# Altium schematic sheet MB_pwr.SchDoc
size 840 x 594 mm; SheetNumber: 5; SheetTotal: 8
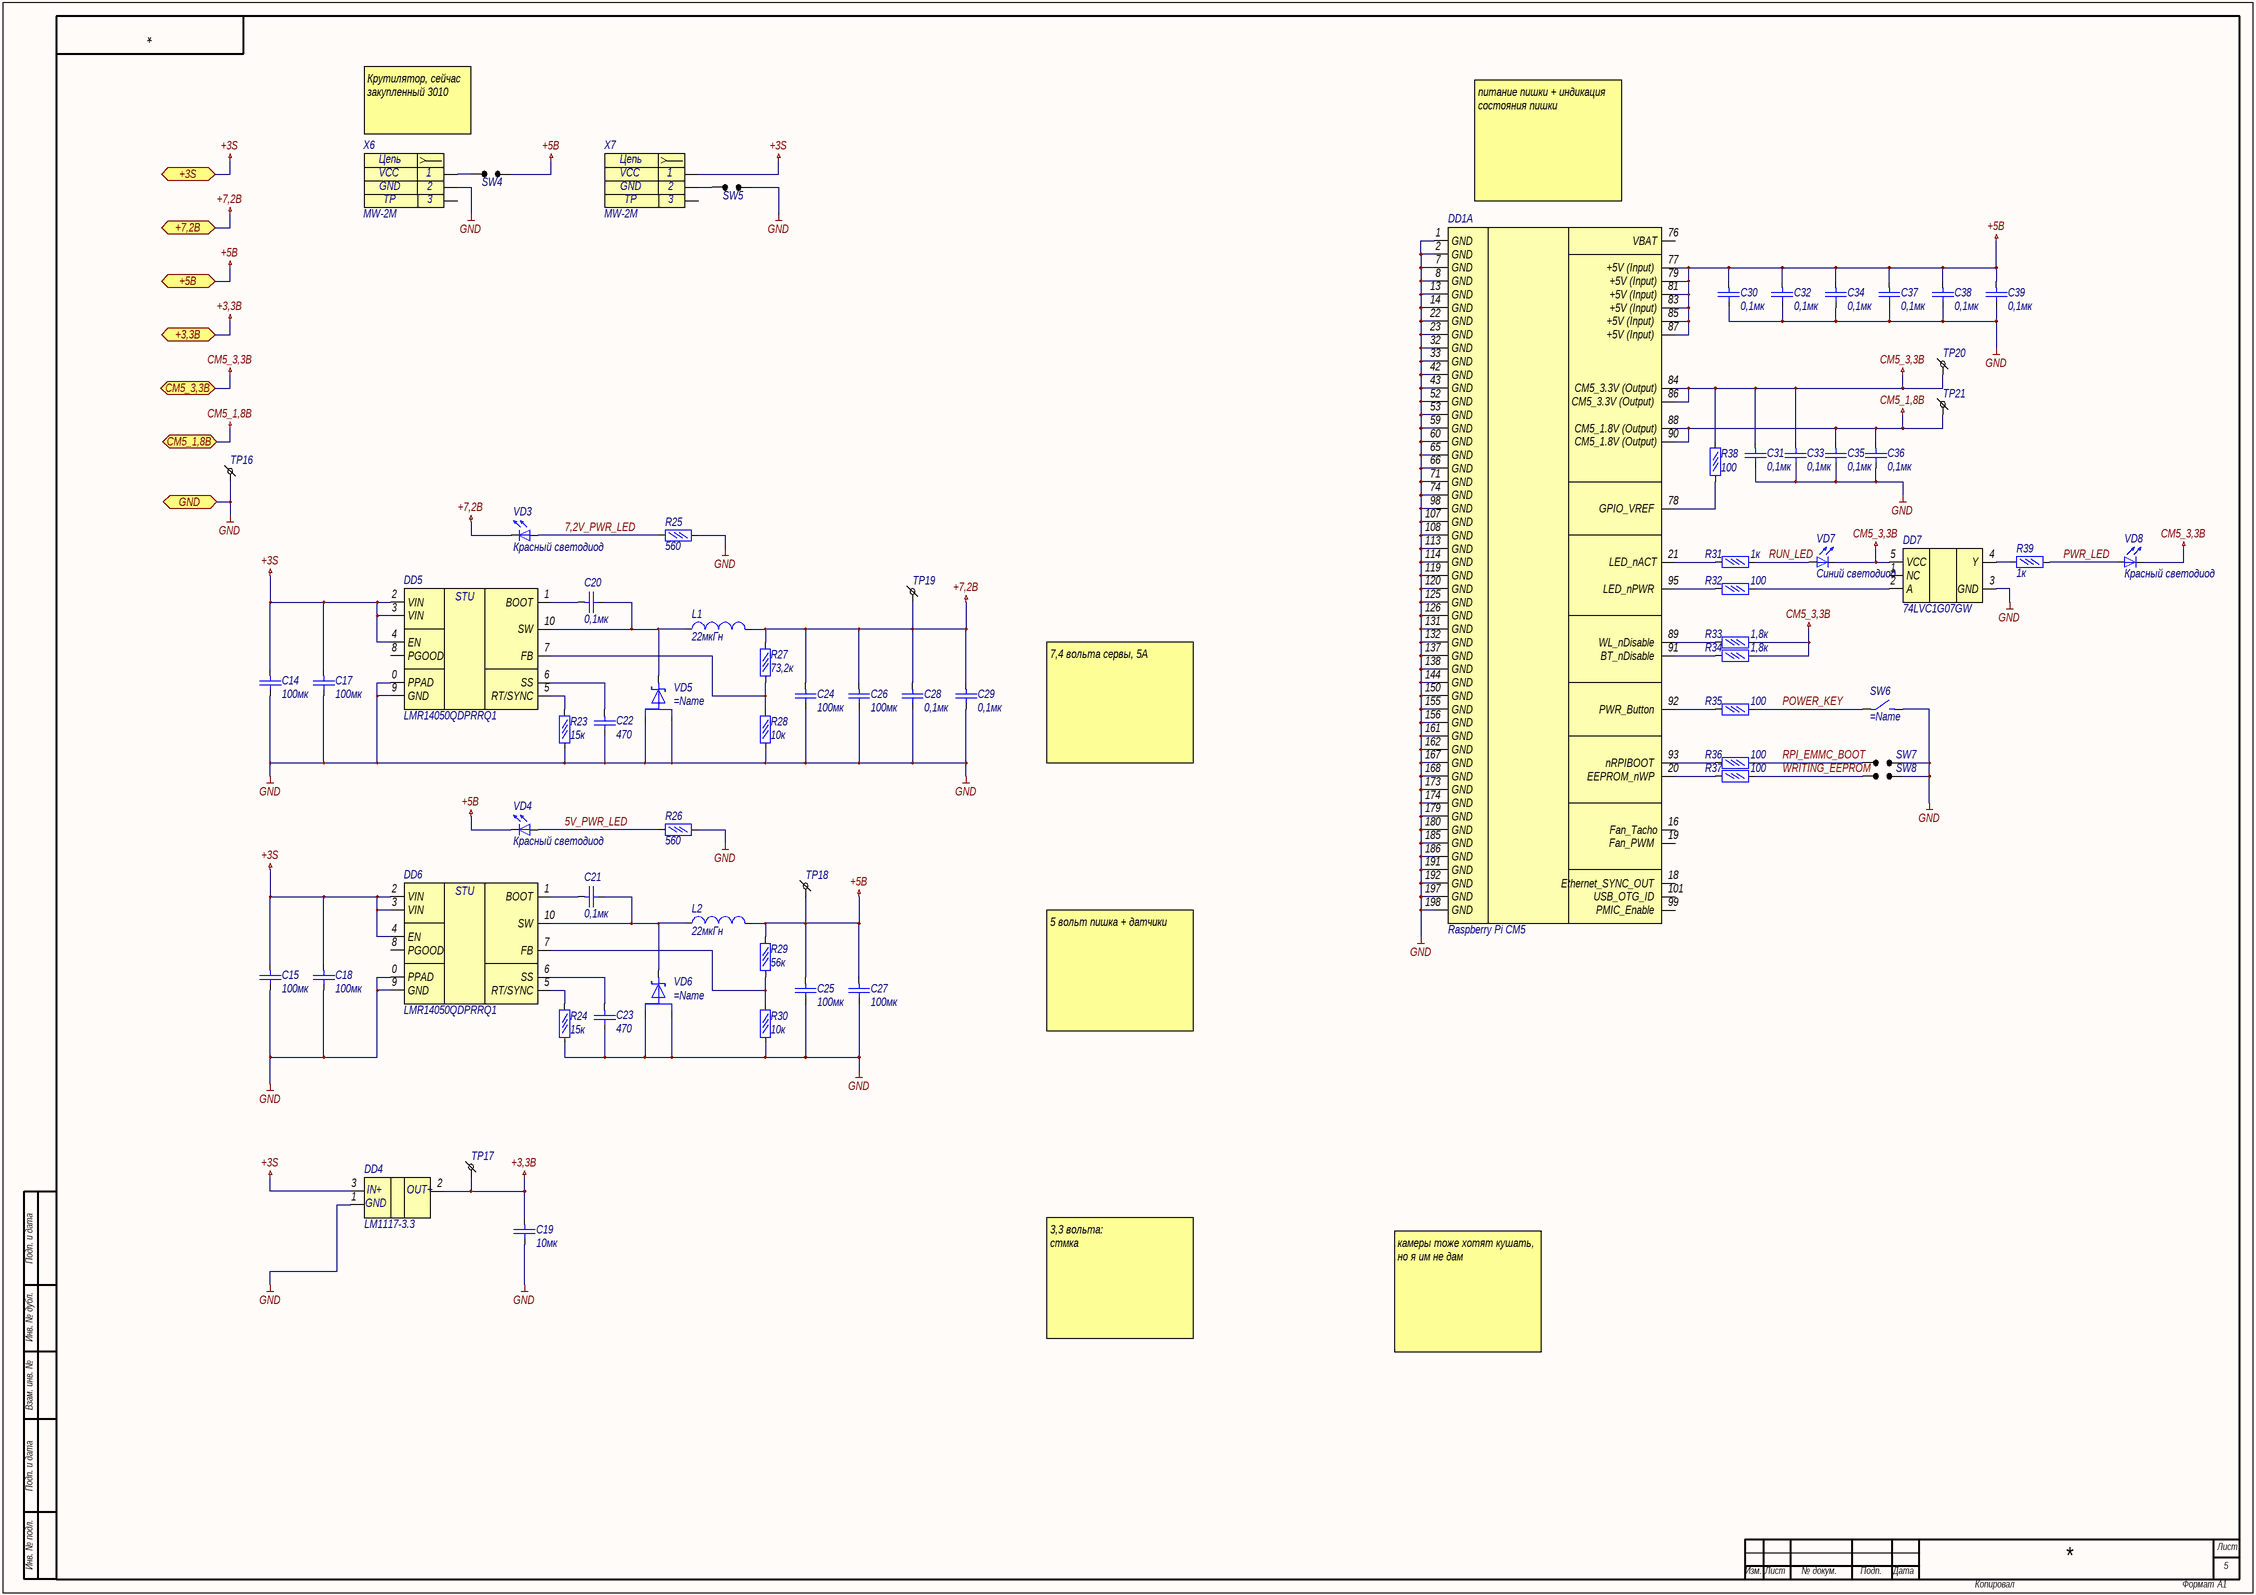
[diagram p0: MB_pwr.SchDoc]

## Parts
DD1  Raspberry Pi CM5  [raspberry_pi_compute_module_4_header]  (part A of 6)
DD4  LM1117-3.3  [SOT-223]
DD5  LMR14050QDPRRQ1  [WSON-10]
DD6  LMR14050QDPRRQ1  [WSON-10]
DD7  74LVC1G07GW  [SOT353]
L1  22мкГн  [SRP1038A]
L2  22мкГн  [SRP1038A]
R23  15к  [R0402]
R24  15к  [R0402]
R25  560  [R0402]
R26  560  [R0402]
R27  73,2к  [R0402]
R28  10к  [R0402]
R29  56к  [R0402]
R30  10к  [R0402]
R31  1к  [R0402]
R32  100  [R0402]
R33  1,8к  [R0402]
R34  1,8к  [R0402]
R35  100  [R0402]
R36  100  [R0402]
R37  100  [R0402]
R38  100  [R0402]
R39  1к  [R0402]
SW4  (no value)  [PLD 1.27X2]
SW5  (no value)  [PLD 1.27X2]
SW6  (no value)  [it-1187]
SW7  (no value)  [PLD 1.27X2]
SW8  (no value)  [PLD 1.27X2]
TP16  TestPoint  [0.5 x 0,9_round]  (value not drawn)
TP17  TestPoint  [0.5 x 0,9_round]  (value not drawn)
TP18  TestPoint  [0.5 x 0,9_round]  (value not drawn)
TP19  TestPoint  [0.5 x 0,9_round]  (value not drawn)
TP20  TestPoint  [0.5 x 0,9_round]  (value not drawn)
TP21  TestPoint  [0.5 x 0,9_round]  (value not drawn)
VD3  Красный светодиод  [0603 - led]
VD4  Красный светодиод  [0603 - led]
VD5  (no value)  [TO-277A]
VD6  (no value)  [TO-277A]
VD7  Синий светодиод  [0603 - led - no point]
VD8  Красный светодиод  [0603 - led - no point]
X6  MW-2M  [DS1020-02-02MVT1R]
X7  MW-2M  [MW-2M]
С14  100мк  [C1210_AA - 2.5]
С15  100мк  [C1210_AA - 2.5]
С17  100мк  [C1210_AA - 2.5]
С18  100мк  [C1210_AA - 2.5]
С19  10мк  [C0603]
С20  0,1мк  [C0402]
С21  0,1мк  [C0402]
С22  470  [C0402]
С23  470  [C0402]
С24  100мк  [C1210_AA - 2.5]
С25  100мк  [C1210_AA - 2.5]
С26  100мк  [C1210_AA - 2.5]
С27  100мк  [C1210_AA - 2.5]
С28  0,1мк  [C0402]
С29  0,1мк  [C0402]
С30  0,1мк  [C0402]
С31  0,1мк  [C0402]
С32  0,1мк  [C0402]
С33  0,1мк  [C0402]
С34  0,1мк  [C0402]
С35  0,1мк  [C0402]
С36  0,1мк  [C0402]
С37  0,1мк  [C0402]
С38  0,1мк  [C0402]
С39  0,1мк  [C0402]

## Ports
+3,3В (bidir), +3S (bidir), +5В (bidir), +7,2В (bidir), CM5_1,8В (bidir), CM5_3,3В (bidir), GND (bidir)

## Nets
+3,3В: DD4.2 TP17.1 С19.2 ; port +3,3В
+3S: DD4.3 DD5.2(VIN) DD5.3(VIN) DD5.4(EN) DD6.2(VIN) DD6.3(VIN) DD6.4(EN) X7.1 С14.2 С15.2 С17.2 С18.2 ; port +3S
+5В: DD1.77(+5V_(Input)) DD1.79(+5V_(Input)) DD1.81(+5V_(Input)) DD1.83(+5V_(Input)) DD1.85(+5V_(Input)) DD1.87(+5V_(Input)) L2.1 R29.2 SW4.2 TP18.1 VD4.2(K) С25.2 С27.2 С30.2 С32.2 С34.2 С37.2 С38.2 С39.2 ; port +5В
+7,2В: L1.1 R27.2 TP19.1 VD3.2(K) С24.2 С26.2 С28.2 С29.2 ; port +7,2В
CM5_1,8В: DD1.88(CM5_1.8V_(Output)) DD1.90(CM5_1.8V_(Output)) TP21.1 С35.2 С36.2 ; port CM5_1,8В
CM5_3,3В: DD1.84(CM5_3.3V_(Output)) DD1.86(CM5_3.3V_(Output)) DD7.5(VCC) R33.2 R34.2 R38.2 TP20.1 VD7.2(K) VD8.2(K) С31.2 С33.2 ; port CM5_3,3В
GND: DD1.1(GND) DD1.2(GND) DD1.7(GND) DD1.8(GND) DD1.13(GND) DD1.14(GND) DD1.22(GND) DD1.23(GND) DD1.32(GND) DD1.33(GND) DD1.42(GND) DD1.43(GND) DD1.52(GND) DD1.53(GND) DD1.59(GND) DD1.60(GND) DD1.65(GND) DD1.66(GND) DD1.71(GND) DD1.74(GND) DD1.98(GND) DD1.107(GND) DD1.108(GND) DD1.113(GND) DD1.114(GND) DD1.119(GND) DD1.120(GND) DD1.125(GND) DD1.126(GND) DD1.131(GND) DD1.132(GND) DD1.137(GND) DD1.138(GND) DD1.144(GND) DD1.150(GND) DD1.155(GND) DD1.156(GND) DD1.161(GND) DD1.162(GND) DD1.167(GND) DD1.168(GND) DD1.173(GND) DD1.174(GND) DD1.179(GND) DD1.180(GND) DD1.185(GND) DD1.186(GND) DD1.191(GND) DD1.192(GND) DD1.197(GND) DD1.198(GND) DD4.1 DD5.0(PPAD) DD5.9(GND) DD6.0(PPAD) DD6.9(GND) DD7.3(GND) R23.1 R24.1 R25.2 R26.2 R28.1 R30.1 SW5.2 SW6.2 SW7.2 SW8.2 TP16.1 VD5.1(A) VD5.2(A) VD6.1(A) VD6.2(A) X6.2 С14.1 С15.1 С17.1 С18.1 С19.1 С22.1 С23.1 С24.1 С25.1 С26.1 С27.1 С28.1 С29.1 С30.1 С31.1 С32.1 С33.1 С34.1 С35.1 С36.1 С37.1 С38.1 С39.1 ; port GND
5V_PWR_LED: R26.1 VD4.1(A)
7,2V_PWR_LED: R25.1 VD3.1(A)
POWER_KEY: R35.2 SW6.1
PWR_LED: R39.2 VD8.1(A)
RPI_EMMC_BOOT: R36.2 SW7.1
RUN_LED: R31.2 VD7.1(A)
WRITING_EEPROM: R37.2 SW8.1
NetDD1_20: DD1.20(EEPROM_nWP) R37.1
NetDD1_21: DD1.21(LED_nACT) R31.1
NetDD1_78: DD1.78(GPIO_VREF) R38.1
NetDD1_89: DD1.89(WL_nDisable) R33.1
NetDD1_91: DD1.91(BT_nDisable) R34.1
NetDD1_92: DD1.92(PWR_Button) R35.1
NetDD1_93: DD1.93(nRPIBOOT) R36.1
NetDD1_95: DD1.95(LED_nPWR) R32.1
NetDD5_1: DD5.1(BOOT) С20.2
NetDD5_5: DD5.5(RT/SYNC) R23.2
NetDD5_6: DD5.6(SS) С22.2
NetDD5_7: DD5.7(FB) R27.1 R28.2
NetDD5_10: DD5.10(SW) L1.2 VD5.3(K) С20.1
NetDD6_1: DD6.1(BOOT) С21.2
NetDD6_5: DD6.5(RT/SYNC) R24.2
NetDD6_6: DD6.6(SS) С23.2
NetDD6_7: DD6.7(FB) R29.1 R30.2
NetDD6_10: DD6.10(SW) L2.2 VD6.3(K) С21.1
NetDD7_2: DD7.2(A) R32.2
NetDD7_4: DD7.4(Y) R39.1
NetSW4_1: SW4.1 X6.1
NetSW5_1: SW5.1 X7.2

Not connected (* = marked no-connect by the designer): DD1 16(Fan_Tacho) 18(Ethernet_SYNC_OUT_) 19(Fan_PWM_) 76(VBAT) 99(PMIC_Enable_) 101(USB_OTG_ID_); DD5 8(PGOOD); DD6 8(PGOOD); DD7 1(NC); X6 0; X7 0

## Notes on the sheet
- Крутилятор, сейчас закупленный 3010
- питание пишки + индикация состояния пишки
- 7,4 вольта сервы, 5А
- 5 вольт пишка + датчики
- 3,3 вольта:
  стмка
- камеры тоже хотят кушать, но я им не дам
- Подп. и дата
- Инв. № дубл.
- Взам. инв. №
- Инв. № подл.
- Лист
- Изм.
- № докум.
- Подп.
- Дата
- Копировал
- Формат
- А1
- (in symbol Header_2) Цепь; 3
- (in symbol LMR14050QDPRRQ1) STU

## Library data of the parts
DD1 = Raspberry Pi CM5: Raspberry Pi Compute Module 5; Name: Raspberry Pi CM5
DD4 = LM1117-3.3: LM1117GS-3.3; Contact_1: IN+; Contact_2: GND; Contact_3: OUT+; Name: LM1117-3.3
DD5 DD6 = LMR14050QDPRRQ1: Стабилизатор напряжения 5А; Name: LMR14050QDPRRQ1
DD7 = 74LVC1G07GW: буферный элемент с открытым стоком; Name: 74LVC1G07GW
L1 L2 = Индуктивность: Value: 22мкГн
R23-R39 = Резистор 0.05Вт: Резистор 0,05Вт
  R23 R24: Value: 15к
  R25 R26: Value: 560
  R27: Value: 73,2к
  R28 R30: Value: 10к
  R29: Value: 56к
  R31 R39: Value: 1к
  R32 R35-R38: Value: 100
  R33 R34: Value: 1,8к
SW4 SW5 SW7 SW8 = Jumper: Перемычка
SW6 = button
VD3 VD4 VD7 VD8 = SMD светодиод: Светодтод SMD
  VD3 VD4 VD8: Name: Красный светодиод
  VD7: Name: Синий светодиод
VD5 VD6 = SS10PH10: Диод Шоттки
X6 X7 = Header_2: Разъем - 2 конт. розетка; Contact_1: VCC; Contact_2: GND; Contact_3: TP; Name: MW-2M
С14 С15 С17-С39 = Кер. конденсатор
  С14 С15 С17 С18 С24-С27: Value: 100мк
  С19: Value: 10мк
  С20 С21 С28-С39: Value: 0,1мк
  С22 С23: Value: 470